# Altium schematic sheet DC-link.SchDoc
size A4; CompanyName: Technische Hochschule Nürnberg Georg Simon Ohm; Organization: UltraZohm; Address1: Kesslerplatz 12; Address2: 90489 Nürnberg; Address3: GERMANY; SheetNumber: 7; SheetTotal: 8; Website: www.ultrazohm.com
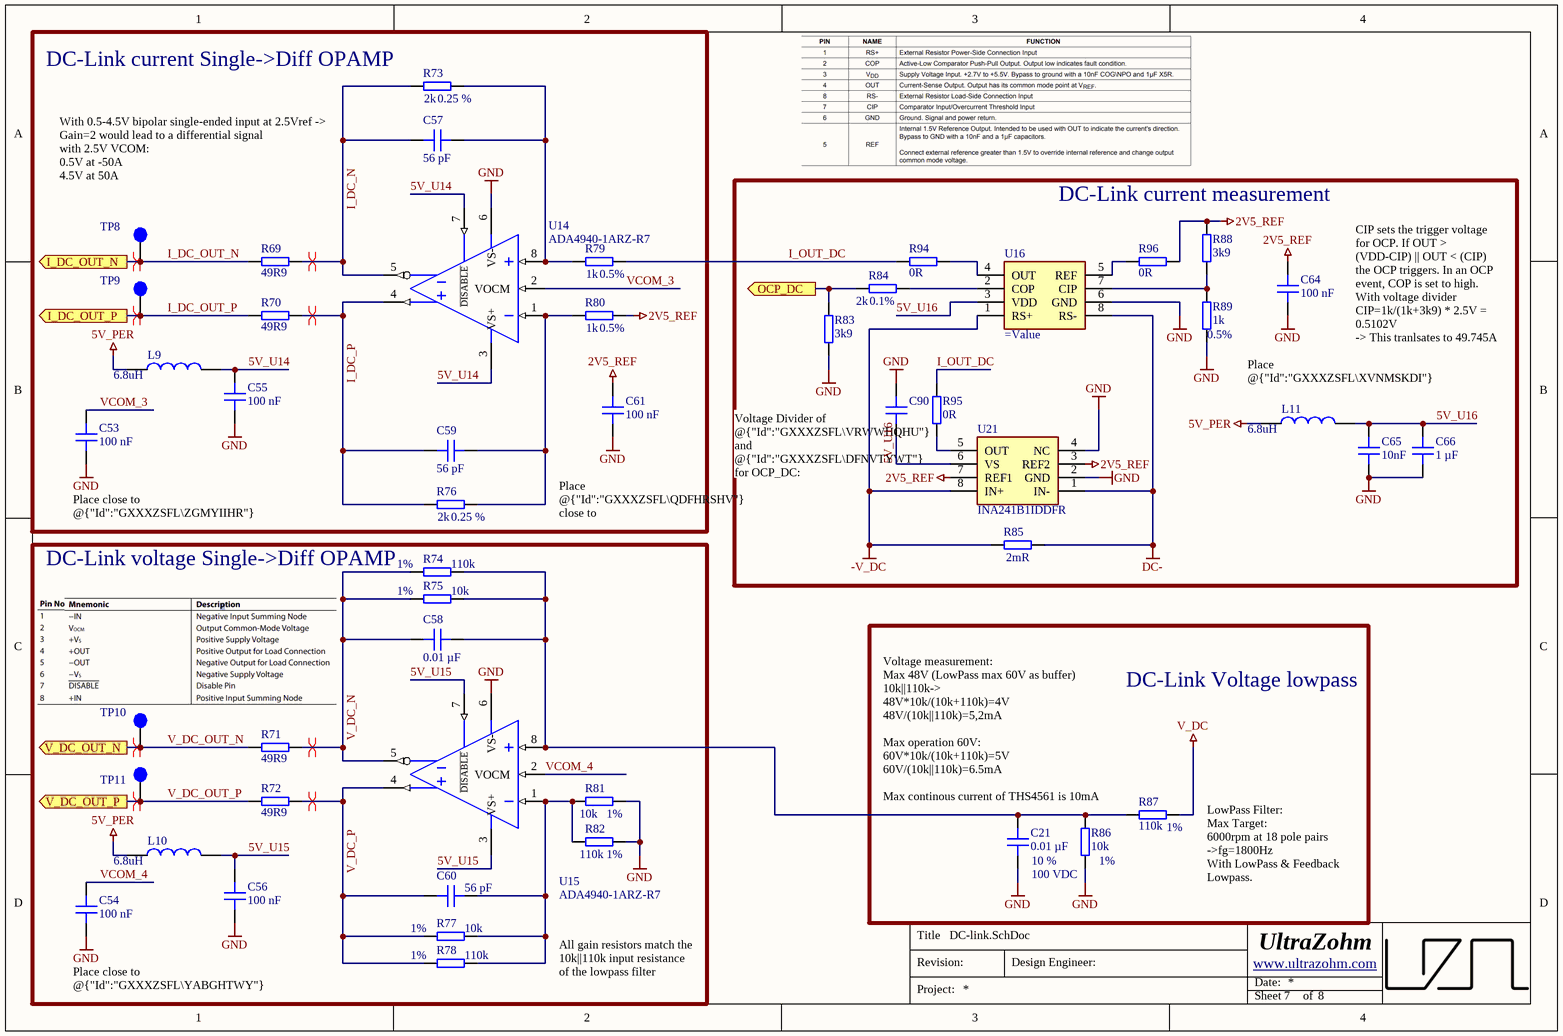
[diagram p0: DC-link.SchDoc]

## Parts
C21  0.01 µF  Tolerance: 10 %  Voltage Rating: 100 VDC  [C_0805]
C53  100 nF  [C_0603]
C54  100 nF  [C_0603]
C55  100 nF  [C_0603]
C56  100 nF  [C_0603]
C57  56 pF  [C_0603]
C58  0.01 µF  [C_0603]
C59  56 pF  [C_0603]
C60  56 pF  [C_0603]
C61  100 nF  [C_0603]
C64  100 nF  [C_0603]
C65  10nF  [C_0603]
C66  1 µF  [C_0603]
C90  100 nF  [C_0603]  (value not drawn)
L9  6.8uH  [INDC1608X95N]
L10  6.8uH  [INDC1608X95N]
L11  6.8uH  [INDC1608X95N]
R69  49R9  [RES 0603_1608]
R70  49R9  [RES 0603_1608]
R71  49R9  [RES 0603_1608]
R72  49R9  [RES 0603_1608]
R73  2k  Tolerance: 0.25 %  [RES 0603_1608]
R74  110k  Tolerance: 1%  [RES 0603_1608]
R75  10k  Tolerance: 1%  [RES 0603_1608]
R76  2k  Tolerance: 0.25 %  [RES 0603_1608]
R77  10k  Tolerance: 1%  [RES 0603_1608]
R78  110k  Tolerance: 1%  [RES 0603_1608]
R79  1k  Tolerance: 0.5%  [RES 0603_1608]
R80  1k  Tolerance: 0.5%  [RES 0603_1608]
R81  10k  Tolerance: 1%  [RES 0603_1608]
R82  110k  Tolerance: 1%  [RES 0603_1608]
R83  3k9  [RES 0603_1608]
R84  2k  Tolerance: 0.1%  [RES 0603_1608]
R85  2mR  [3921]
R86  10k  Tolerance: 1%  [RES 0603_1608]
R87  110k  Tolerance: 1%  [RES 0603_1608]
R88  3k9  [RES 0603_1608]
R89  1k  Tolerance: 0.5%  [RES 0603_1608]
R94  0R  [RES 0603_1608]
R95  0R  [RES 0603_1608]
R96  0R  [RES 0603_1608]
TP8  Testpoint 1mm  [TP_1mm]  (value not drawn)  (no BOM)
TP9  Testpoint 1mm  [TP_1mm]  (value not drawn)  (no BOM)
TP10  Testpoint 1mm  [TP_1mm]  (value not drawn)  (no BOM)
TP11  Testpoint 1mm  [TP_1mm]  (value not drawn)  (no BOM)
U14  ADA4940-1ARZ-R7  [SOT127P600X175-8N]
U15  ADA4940-1ARZ-R7  [SOT127P600X175-8N]
U16  (no value)  [SOP65P490X110-8N]
U21  INA241B1IDDFR  [SOT65P280X110-8N]

## Blocks framed on the sheet
DC-Link current Single->Diff OPAMP: C53 C55 C57 C59 C61 L9 R69 R70 R73 R76 R79 R80 TP8 TP9 U14
DC-Link current measurement: C64-C66 C90 L11 R83-R85 R88 R89 R94-R96 U16 U21
DC-Link voltage Single->Diff OPAMP: C54 C56 C58 C60 L10 R71 R72 R74 R75 R77 R78 R81 R82 TP10 TP11 U15
DC-Link Voltage lowpass: C21 R86 R87

## Ports
I_DC_OUT_N (out), I_DC_OUT_P (out), OCP_DC (out), V_DC_OUT_N (out), V_DC_OUT_P (out)

## Nets
2V5_REF: C61.1 C64.1 R80.2 R88.2 R96.2 U21.3(REF2) U21.7(REF1)
5V_PER: L9.1 L10.1 L11.1
-V_DC: R85.1 U16.1(RS+) U21.8(IN+)
DC-: R85.2 U16.8(RS-) U21.1(IN-)
GND: C21.1 C53.1 C54.1 C55.1 C56.1 C61.2 C64.2 C65.1 C66.1 C90.1 R81.1 R82.2 R83.1 R86.1 R89.1 U14.6(VS-) U15.6(VS-) U16.6(GND) U21.2(GND) U21.4(NC)
V_DC: R87.2
5V_U14: C55.2 L9.2 U14.3(VS+) U14.7(~{DISABLE})
5V_U15: C56.2 L10.2 U15.3(VS+) U15.7(~{DISABLE})
5V_U16: C65.2 C66.2 C90.2 L11.2 U16.3(VDD) U21.6(VS)
I_DC_N: C57.1 R69.2 R73.1 U14.5(VOUT-)
I_DC_OUT_N: R69.1 TP8.1 ; port I_DC_OUT_N
I_DC_OUT_P: R70.1 TP9.1 ; port I_DC_OUT_P
I_DC_P: C59.2 R70.2 R76.2 U14.4(VOUT+)
I_OUT_DC: R79.2 R94.1 R95.2
OCP_DC: R83.2 R84.2 ; port OCP_DC
V_DC_N: C58.1 R71.2 R74.1 R75.2 U15.5(VOUT-)
V_DC_OUT_N: R71.1 TP10.1 ; port V_DC_OUT_N
V_DC_OUT_P: R72.1 TP11.1 ; port V_DC_OUT_P
V_DC_P: C60.2 R72.2 R77.2 R78.1 U15.4(VOUT+)
VCOM_3: C53.2 U14.2(VOCM)
VCOM_4: C54.2 U15.2(VOCM)
NetC21_2: C21.2 C58.2 R74.2 R75.1 R86.2 R87.1 U15.8(VIN+)
NetC57_2: C57.2 R73.2 R79.1 U14.8(VIN+)
NetC59_1: C59.1 R76.1 R80.1 U14.1(VIN-)
NetC60_1: C60.1 R77.1 R78.2 R81.2 R82.1 U15.1(VIN-)
NetR84_1: R84.1 U16.2(COP)
NetR88_1: R88.1 R89.2 U16.7(CIP)
NetR94_2: R94.2 U16.4(OUT)
NetR95_1: R95.1 U21.5(OUT)
NetR96_1: R96.1 U16.5(REF)

## Layout directives
differential pair: I_DC_N, I_DC_OUT_N, I_DC_OUT_P, I_DC_P, V_DC_N, V_DC_OUT_N, V_DC_OUT_P, V_DC_P

## Notes on the sheet
- With 0.5-4.5V bipolar single-ended input at 2.5Vref ->
  Gain=2 would lead to a differential signal
  with 2.5V VCOM:
  0.5V at -50A
  4.5V at 50A
- Place @{"Id":"GXXXZSFL\XVNMSKDI"} close to U16
- CIP sets the trigger voltage for OCP. If OUT > (VDD-CIP) || OUT < (CIP) the OCP triggers. In an OCP event, COP is set to high.
  With voltage divider CIP=1k/(1k+3k9) * 2.5V = 0.5102V
  -> This tranlsates to 49.745A
- (near C53) Place close to @{"Id":"GXXXZSFL\ZGMYIIHR"} OPAMP
- Place @{"Id":"GXXXZSFL\QDFHRSHV"} close to @{"Id":"GXXXZSFL\RDUCETHW"}
- (near C90) Voltage Divider of @{"Id":"GXXXZSFL\VRWWHQHU"} and @{"Id":"GXXXZSFL\DFNVTYWT"} for OCP_DC:
  Scale Output
  5V -> 3V3
  (5V*3k9)/3k9+2k)
  -> 3.31V
- Voltage measurement:
  Max 48V (LowPass max 60V as buffer)
  10k||110k->
  48V*10k/(10k+110k)=4V
  48V/(10k||110k)=5,2mA
  Max operation 60V:
  60V*10k/(10k+110k)=5V
  60V/(10k||110k)=6.5mA
  Max continous current of THS4561 is 10mA
- (near R87) LowPass Filter:
  Max Target:
  6000rpm at 18 pole pairs
  ->fg=1800Hz
  With LowPass & Feedback Lowpass.
- Place close to @{"Id":"GXXXZSFL\YABGHTWY"} OPAMP
- All gain resistors match the 10k||110k input resistance of the lowpass filter
- Title
- Revision:
- Design Engineer:
- Date:
- Project:
- Sheet
- of

## Library data of the parts
C21 = HV0805X7R103K101NT: 100V 10nF 0805 Multilayer Ceramic Capacitors MLCC - SMD/SMT ROHS; Manufacturer: AIDE; Created from: KIlhan; Manufacturer Part Number: HV0805X7R103K101NT; PartID: 128; Created On: 7/5/2023 3:42:28 PM; ComponentLink1Description: Datasheet; ComponentLink1URL: https://datasheet.lcsc.com/lcsc/2103311437_AIDE-HV1210X7R332K202NT_C2691813.pdf; Component Type: Capacitor 0805; Device Package: 0805; Last Updated: 7/5/2023 3:42:28 PM; Mounting Type: SMD; Operating Temperature: -55 - 125°C; Series: C; Supplier 1: JLCPCB; Supplier Part Number 1: HV0805X7R103K101NT; Type: Capacitor; Value: 0.01 µF; Live Cycle Status: 1; Stock number: not stored; LCSC Part Number: C2691724
C53-C56 C61 C64 C90 = CC0603KRX7R9BB104: Capacitor 0603, 50 VDC, 100 nF, X7R; Manufacturer: YAGEO; Tolerance: 10 %; Voltage Rating: 50 VDC; Created from: AGeiger; Manufacturer Part Number: CC0603KRX7R9BB104; PartID: 102; Created On: 8/22/2022 2:35:53 PM; ComponentLink1Description: Datasheet; ComponentLink1URL: https://datasheet.lcsc.com/lcsc/1809301912_YAGEO-CC0603KRX7R9BB104_C14663.pdf; Component Type: Capacitor 0603; Device Package: 0603; Last Updated: 8/22/2022 2:35:53 PM; Mounting Type: SMD; Operating Temperature: -55 - 125°C; Series: X7R; Supplier 1: LCSC; Supplier Part Number 1: C14663; Type: Capacitor; Value: 100 nF; Live Cycle Status: 1; Supplier 2: Mouser; Supplier Part Number 2: 603-CC603KRX7R9BB104; LCSC Part Number: C14663
C57 C59 C60 = CL10C560JB8NNNC: Capacitor 0603, 50 VDC, 56 pF, C0G; Manufacturer: Samsung Electro-Mechanics; Tolerance: 5 %; Voltage Rating: 50 VDC; Created from: DHufnagel; Manufacturer Part Number: CL10C560JB8NNNC; PartID: 92; Created On: 12/20/2020 1:54:13 PM; ComponentLink1Description: Datasheet; ComponentLink1URL: https://www.mouser.de/datasheet/2/585/MLCC-1837944.pdf; Component Type: Capacitor 0603; Device Package: 0603; Last Updated: 12/20/2020 4:24:16 PM; Mounting Type: SMD; Operating Temperature: -55 - 125°C; Series: CL; Supplier 1: Mouser; Supplier Part Number 1: 187-CL10C560JB8NNNC; Supplier 2: LCSC; Supplier Part Number 2: C39148; Type: Capacitor; Value: 56 pF; Live Cycle Status: 1; LCSC Part Number: C39148; Stock number: not stored
C58 = C1608C0G1E103JT000N: 25V 10nF C0G ±5% 0603 Multilayer Ceramic Capacitors MLCC - SMD/SMT ROHS; Manufacturer: TDK; Voltage Rating: 25 VDC; Created from: KIlhan; Manufacturer Part Number: C1608C0G1E103JT000N; PartID: 127; Created On: 7/5/2023 3:26:52 PM; ComponentLink1Description: Datasheet; ComponentLink1URL: https://product.tdk.com/system/files/dam/doc/product/capacitor/ceramic/mlcc/catalog/mlcc_commercial_general_en.pdf; Component Type: Capacitor 0603; Device Package: 0603; Last Updated: 7/5/2023 3:26:52 PM; Mounting Type: SMD; Operating Temperature: -55 - 125°C; Series: C; Supplier 1: Mouser; Supplier Part Number 1: 810-C1608C0G1E103J; Type: Capacitor; Tolerance: 5 %; Value: 0.01 µF; Live Cycle Status: 1; Stock number: not stored; LCSC Part Number: C343007
C65 = CT41G-0603-2X1-50V-0.01μF-K(N): 50V 10nF 2X1 ±10%; Manufacturer: TORCH; Voltage Rating: 50 VDC; Created from: KIlhan; Manufacturer Part Number: CT41G-0603-2X1-50V-0.01μF-K(N); PartID: 130; Created On: 7/5/2023 6:57:50 PM; ComponentLink1Description: Datasheet; ComponentLink1URL: https://datasheet.lcsc.com/lcsc/1809291621_TORCH-CT41G-0603-2X1-50V-0-01-F-K-N_C136131.pdf; Component Type: Capacitor 0603; Device Package: 0603; Last Updated: 7/5/2023 6:57:50 PM; Mounting Type: SMD; Operating Temperature: -55 - 125°C; Supplier 1: LCSC; Supplier Part Number 1: C136131; Type: Capacitor; Tolerance: 10 %; Value: 10nF; Live Cycle Status: 1; Stock number: not stored; LCSC Part Number: C136131
C66 = UMK107AB7105KA-T: 50V 1uF X7R ±10% 0603 Multilayer Ceramic Capacitors MLCC - SMD/SMT ROHS; Manufacturer: Taiyo Yuden; Voltage Rating: 50 VDC; Created from: NDiringer; Manufacturer Part Number: UMK107AB7105KA-T; PartID: 98; Created On: 8/9/2022 9:35:02 AM; ComponentLink1Description: Datasheet; ComponentLink1URL: https://www.mouser.de/datasheet/2/396/mlcc02_e-1307760.pdf; Component Type: Capacitor 0603; Device Package: 0603; Last Updated: 9/21/2022 4:11:37 PM; Mounting Type: SMD; Operating Temperature: -55 - 125°C; Series: X7R; Type: Capacitor; Tolerance: 10 %; Value: 1 µF; Live Cycle Status: 1; Stock number: not stored; LCSC Part Number: C105174; Supplier 1: LCSC; Supplier Part Number 1: C105174; Supplier 2: Mouser; Supplier Part Number 2: 963-UMK107AB7105MA-T
L9-L11 = CMCW1608F6R8KTT: 6.8uH ±10% 0603 Inductors (SMD) ROHS; Manufacturer: Cybermax; MF: EPCOS / TDK; DCR: 320m; Rated Current: 0.85 A; Type: fixed inductor; DC current: 15mA; Created from: KIlhan; MPN: B82464G4154M; Supplier 1: LCSC; Supplier Part Number 1: C961362; Value: 6.8uH; Manufacturer Part Number: CMCW1608F6R8KTT; PartID: 17; Created On: 7/5/2023 8:42:04 PM; ComponentLink1Description: Datasheet; ComponentLink1URL: https://jlcpcb.com/partdetail/Cybermax-CMCW1608F6R8KTT/C961362; Component Type: SMD fixed inductor; Device Package: SMD; Last Updated: 7/5/2023 8:42:04 PM; Mounting Type: SMD; Operating Temperature: -40 - 85 °C; Live Cycle Status: 1; Stock number: C961362; LCSC Part Number: C961362
R69-R72 = TNPW060349R9BEEA: 125mW Thin Film Resistor ±0.1% ±25ppm/℃ 49.9Ω 0603; Manufacturer: Vishay Intertech; Created from: KIlhan; Manufacturer Part Number: TNPW060349R9BEEA; PartID: 286; Created On: 7/5/2023 8:32:44 PM; ComponentLink1Description: Datasheet; ComponentLink1URL: https://www.vishay.com/docs/28758/tnpw_e3.pdf; Component Type: SMD resistor; Device Package: 0603; Last Updated: 7/5/2023 8:32:44 PM; Mounting Type: SMD; Supplier 1: Mouser; Supplier Part Number 1: 71-TNPW060349R9BEEA; Type: Resistor; Tolerance: 0.1%; Value: 49R9; Live Cycle Status: 1; LCSC Part Number: C2075693; Stock number: not stored
R73 R76 = RT0603CRE072KL: 100mW Thin Film Resistor ±50ppm/℃ ±0.25% 2kΩ 0603 Chip Resistor - Surface Mount ROHS; Manufacturer: YAGEO; Created from: KIlhan; Manufacturer Part Number: RT0603CRE072KL; PartID: 287; Created On: 7/5/2023 10:38:54 PM; ComponentLink1Description: Datasheet; ComponentLink1URL: https://www.mouser.de/datasheet/2/447/PYu_RT_1_to_0_01_RoHS_L_12-3003070.pdf; Component Type: SMD resistor; Device Package: 0603; Last Updated: 7/5/2023 10:38:54 PM; Mounting Type: SMD; Supplier 1: Mouser; Supplier Part Number 1: RT0603CRE072KL; Type: Resistor; Value: 2k; Live Cycle Status: 1; Stock number: not stored; LCSC Part Number: C705921
R74 R78 R82 R87 = WR06X1103FTL: 100mW Thick Film Resistors ±100ppm/℃ ±1% 110kΩ 0603 Chip Resistor - Surface Mount ROHS; Manufacturer: Walsin Tech Corp; Created from: KIlhan; Manufacturer Part Number: WR06X1103FTL; PartID: 282; Created On: 7/5/2023 6:31:24 PM; ComponentLink1Description: Datasheet; ComponentLink1URL: https://jlcpcb.com/partdetail/Walsin_TechCorp-WR06X1103FTL/C168275; Component Type: SMD resistor; Device Package: 0603; Last Updated: 7/5/2023 6:31:24 PM; Mounting Type: SMD; Supplier 1: LCSC; Supplier Part Number 1: C168275; Type: Resistor; Value: 110k; Live Cycle Status: 1; Stock number: not stored; LCSC Part Number: C168275
R75 R77 R81 R86 = 0603WAF1002T5E: SMD resistor 1%; Manufacturer: UNI-ROYAL; Created from: AGeiger; Manufacturer Part Number: 0603WAF1002T5E; PartID: 265; Created On: 6/1/2023 6:49:29 AM; ComponentLink1Description: Datasheet; ComponentLink1URL: https://datasheet.lcsc.com/lcsc/2206010045_UNI-ROYAL-Uniroyal-Elec-0603WAF1002T5E_C25804.pdf; Component Type: SMD resistor; Device Package: 0603; Last Updated: 6/1/2023 6:49:29 AM; Mounting Type: SMD; Supplier 1: LCSC; Supplier Part Number 1: C25804; Type: Resistor; Value: 10k; Live Cycle Status: 1; LCSC Part Number: C25804
R79 R80 R89 = 0603WAD1001T5E: SMD resistor E24 series 470 kOhms 100-200 mW 0603 1%; Manufacturer: UNI-ROYAL(Uniroyal Elec); Created from: NDiringer; Manufacturer Part Number: 0603WAD1001T5E; PartID: 261; Created On: 3/17/2023 3:28:58 PM; ComponentLink1Description: Datasheet; ComponentLink1URL: https://jlcpcb.com/partdetail/396162-0603WAD2702T5E/C407605; Component Type: SMD resistor; Device Package: 0603; Last Updated: 3/17/2023 3:28:58 PM; Mounting Type: SMD; Supplier 1: LCSC/JLCPCB; Supplier Part Number 1: C51218; Type: Resistor; Value: 1k; Live Cycle Status: 1; Stock number: not stored; LCSC Part Number: C51218
R83 R88 = RT0603FRE073K9L: SMD resistor E24 series; Manufacturer: YAGEO; Tolerance: 1%; Created from: DHufnagel; Manufacturer Part Number: RT0603FRE073K9L; PartID: 250; Created On: 12/14/2020 4:17:14 PM; ComponentLink1Description: Datasheet; ComponentLink1URL: https://www.mouser.de/datasheet/2/447/PYu_RT_1_to_0_01_RoHS_L_12-3003070.pdf; Component Type: SMD resistor; Device Package: 0603; Last Updated: 7/5/2023 6:34:06 PM; Mounting Type: SMD; Supplier 1: Mouser; Supplier Part Number 1: 603-RT0603FRE073K9L; Type: Resistor; Value: 3k9; Live Cycle Status: 1; Stock number: not stored; LCSC Part Number: C863790
R84 = ERJ-PB3B2001V: SMD resistor 0.1%; Manufacturer: Panasonic; Created from: DHufnagel; Manufacturer Part Number: ERJ-PB3B2001V; PartID: 215; Created On: 12/14/2020 4:17:14 PM; ComponentLink1Description: Datasheet; ComponentLink1URL: https://www.mouser.de/datasheet/2/315/AOA0000C328-1530132.pdf; Component Type: SMD resistor; Device Package: 0603; Last Updated: 3/2/2021 2:07:32 PM; Mounting Type: SMD; Supplier 1: Mouser; Supplier Part Number 1: 667-ERJ-PB3B2001V; Supplier 2: LCSC; Supplier Part Number 2: C189729; Type: Resistor; Value: 2k; Live Cycle Status: 1; Stock number: not stored; LCSC Part Number: C189729
R85 = PU3921FKMP50R002L: Shunt resistor 2mOhm, 5W, 1%; Manufacturer: YAGEO; Created from: DHufnagel; Manufacturer Part Number: PU3921FKMP50R002L; PartID: 236; Created On: 7/12/2022 7:38:48 AM; ComponentLink1Description: Datasheet; ComponentLink1URL: https://www.mouser.de/datasheet/2/447/PYu_PU_51_RoHS_L_8-3003083.pdf; Component Type: Shunt SMD resistor; Device Package: 3921; Last Updated: 6/16/2023 12:23:12 PM; Mounting Type: SMD; Supplier 1: Mouser; Supplier Part Number 1: 603-PU3921FKMP50R002; Type: Shunt; Tolerance: 1%; Value: 2mR; Live Cycle Status: 1; Stock number: not stored; LCSC Part Number: C2090244
R94-R96 = RC0603JR-070RL: SMD resistor E24 series; Manufacturer: YAGEO; Tolerance: 5%; Created from: MGremer; Manufacturer Part Number: RC0603JR-070RL; PartID: 1; Created On: 12/14/2020 4:17:14 PM; ComponentLink1Description: Datasheet; ComponentLink1URL: https://www.mouser.de/datasheet/2/447/PYu-RC_Group_51_RoHS_L_10-1664068.pdf; Component Type: SMD resistor; Device Package: 0603; Last Updated: 3/4/2021 9:09:42 AM; Mounting Type: SMD; Supplier 1: Mouser; Supplier Part Number 1: 603-RC0603JR-070RL; Type: Resistor; Value: 0R; Live Cycle Status: 1; Stock number: Labor SMD Container; LCSC Part Number: C21189; Supplier 2: LCSC; Supplier Part Number 2: C21189
TP8-TP11 = NULL: Manufacturer Part Number: NULL; Created from: AGeiger; Created: 2018_06_25_AGeiger; Value: Testpoint 1mm; PartID: 9; Created On: 9/20/2022 1:14:57 PM; Component Type: Testpoint; Last Updated: 9/20/2022 1:15:39 PM; Manufacturer: NULL; Supplier 1: NULL; Supplier Part Number 1: NULL; Type: Testpoint; Live Cycle Status: 1
U14 U15 = ADA4940-1ARZ-R7: Fully Differential Amplifier, Ultralow-Power,Low Distortion, 260-MHz; Manufacturer: Analog Devices; Channels: 1; GBP: 260 MHz; CMRR: 86 dB; Created from: DHufnagel; Manufacturer Part Number: ADA4940-1ARZ-R7; PartID: 14; Created On: 8/18/2022 12:53:27 PM; ComponentLink1Description: Datasheet; ComponentLink1URL: https://www.mouser.de/datasheet/2/609/ada4940_1_4940_2-2955874.pdf; Component Type: Differential Amplifier; Device Package: SOIC-8; Last Updated: 8/18/2022 1:04:18 PM; Mounting Type: SMD; Operating Temperature: -40 - 105°C; Series: ADA4940-1; Supplier 1: Mouser; Supplier Part Number 1: 584-ADA4940-1ARZ; Supplier 2: Digi-Key; Supplier Part Number 2: 505-ADA4940-1ARZ-ND; Supplier 3: LCSC; Supplier Part Number 3: C730049; Type: Differential Amplifiers; Live Cycle Status: 1; LCSC Part Number: C730049; Stock number: not stored
U16 = MAX40056TAUA+T: Current Sense Amplifier, 300kHz, -0.1V to 65V CMV, 2 Channel; Manufacturer_Name: Maxim Integrated; Channels: 2; CMRR: 140dB; Created from: KIlhan; Datasheet Link: https://pdfserv.maximintegrated.com/en/ds/MAX40056F-MAX40056U.pdf; Height: 1.1mm; Manufacturer_Part_Number: MAX40056TAUA+; Mouser Part Number: 700-MAX40056TAUA+; Mouser Price/Stock: https://www.mouser.co.uk/ProductDetail/Maxim-Integrated/MAX40056TAUA%2b?qs=wnTfsH77Xs6U0RpBmDIzAw%3D%3D; Arrow Part Number: MAX40056TAUA+; Arrow Price/Stock: https://www.arrow.com/en/products/max40056taua/maxim-integrated?region=nac; Manufacturer Part Number: MAX40056TAUA+T; PartID: 21; Created On: 7/5/2023 11:17:18 PM; ComponentLink1Description: Datasheet; ComponentLink1URL: https://datasheets.maximintegrated.com/en/ds/MAX40056F-MAX40056U.pdf; Component Type: Operational Amplifier; Device Package: uMAX-8; Last Updated: 7/5/2023 11:17:18 PM; Manufacturer: Maxim Integrated; Mounting Type: SMD; Operating Temperature: -40 to +125°C; Series: MAX40056; Supplier 1: Mouser; Supplier Part Number 1: 700-MAX40056TAUA+T; Type: Current Sense Amplifier; GBP: 300 kHz; Live Cycle Status: 1; LCSC Part Number: C4550714; Stock number: not stored
U21 = INA241B1IDDFR: Current Sense Amplifiers -5-V to 110-V bidirectional high-precision current sense amplifier with enhanced PWM rejection; Manufacturer_Name: Texas Instruments; Channels: 1; CMRR: 120 dB; Created from: KIlhan; GBP: 1.1 MHz; Datasheet Link: https://www.ti.com/general/docs/suppproductinfo.tsp?distId=26&gotoUrl=https://www.ti.com/lit/gpn/ina241a; Height: 1.1mm; Manufacturer_Part_Number: INA241B1IDDFR; Mouser Part Number: 595-INA241B1IDDFR; Mouser Price/Stock: https://www.mouser.de/ProductDetail/Texas-Instruments/INA241B1IDDFR?qs=IPgv5n7u5Qb8VGovuCsC%2FQ%3D%3D; Arrow Part Number: INA241B1IDDFR; Arrow Price/Stock: https://www.arrow.com/en/products/ina241b1iddfr/texas-instruments?q=INA241B1IDDFR; Manufacturer Part Number: INA241B1IDDFR; ComponentLink1Description: Datasheet; ComponentLink1URL: https://www.ti.com/lit/ds/symlink/ina241a.pdf?HQS=dis-mous-null-mousermode-dsf-pf-null-wwe&ts=1687715365898&ref_url=https%253A%252F%252Fwww.mouser.de%252F; Component Type: Operational Amplifier; Created On: 6/25/2023 7:15:05 PM; Last Updated: 7/11/2023 4:11:28 PM; LCSC Part Number: C7433256; Live Cycle Status: 1; Manufacturer: Texas Instruments; Mounting Type: SMD; Operating Temperature: -40 to +125°C; PartID: 20; Series: INA241B; Stock number: not stored; Supplier 1: Mouser; Supplier Part Number 1: 595-INA241B1IDDFR; Type: Current Sense Amplifier